# Altium schematic sheet CloudKon_WifiRelay.SchDoc
size A4
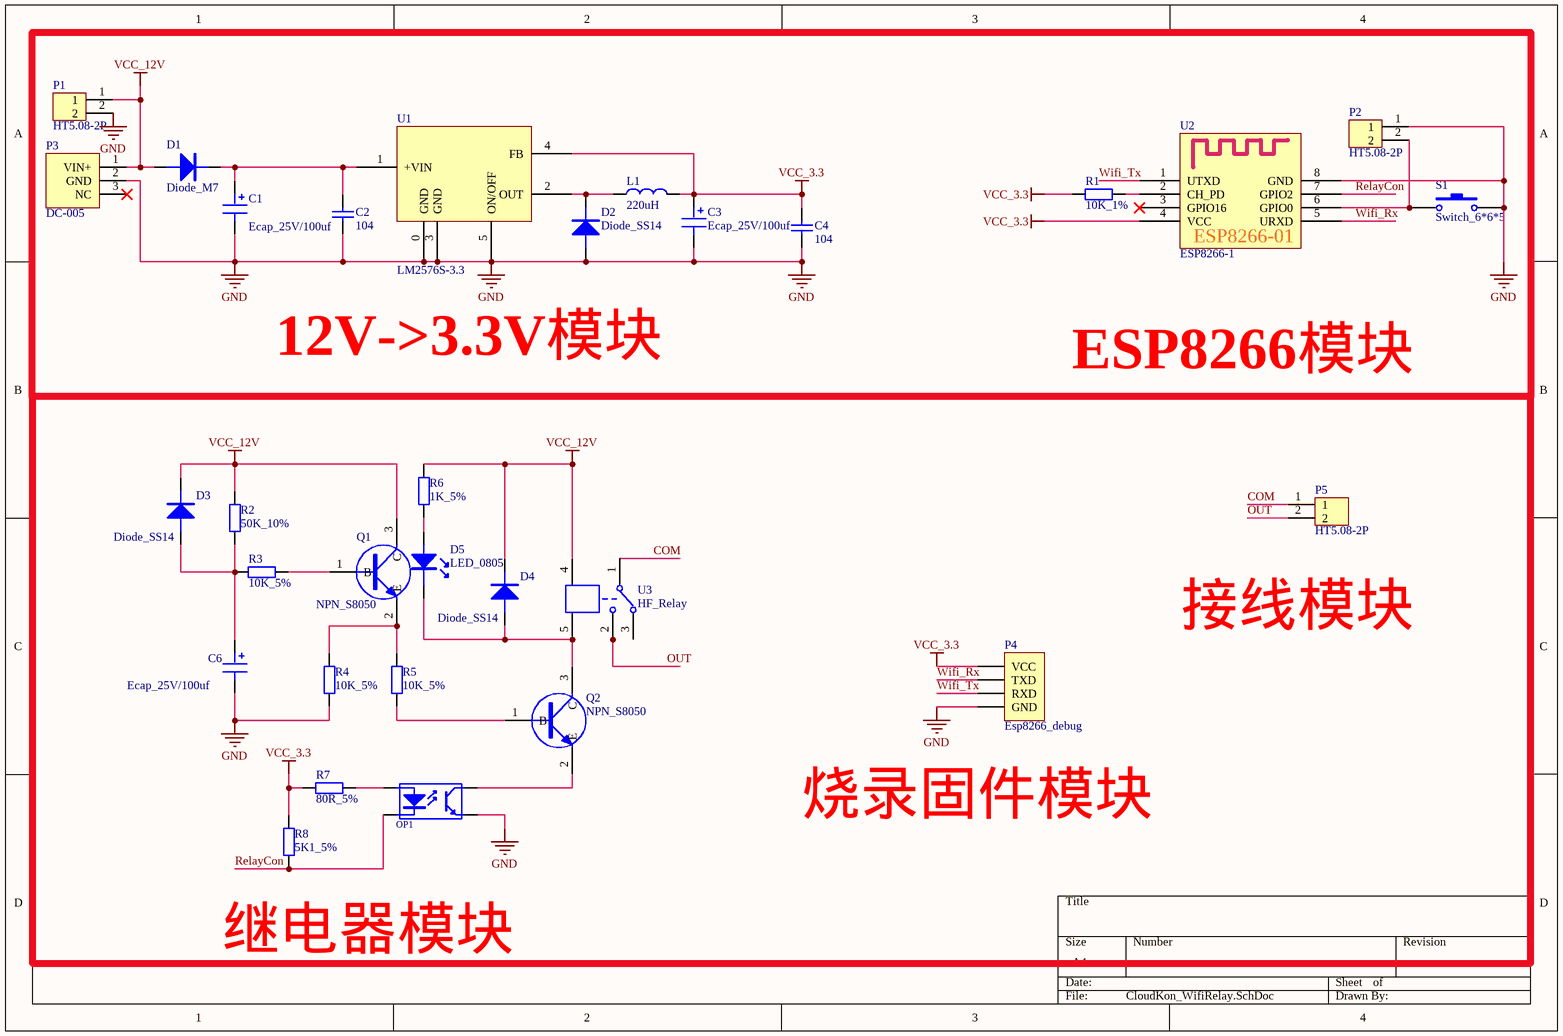
[diagram p0: CloudKon_WifiRelay.SchDoc]

## Parts
C1  Ecap_25V/100uf  [sip-cap-100uf-25v - duplicate]
C2  104  [0805_Cap]
C3  Ecap_25V/100uf  [sip-cap-100uf-25v - duplicate]
C4  104  [0805_Cap]
C6  Ecap_25V/100uf  [sip-cap-100uf-25v - duplicate]
D1  Diode_M7  [M7]
D2  Diode_SS14  [M7]
D3  Diode_SS14  [M7]
D4  Diode_SS14  [M7]
D5  LED_0805  [0805_LED]
L1  220uH  [LL_1A]
OP1  EL817  [E817-SMD]  (value not drawn)
P1  HT5.08-2P  [sip2]
P2  HT5.08-2P  [sip2]
P3  DC-005  [DC-5.5-2.1mm]
P4  Esp8266_debug  [sip4]
P5  HT5.08-2P  [HP2PA-5.08]
Q1  NPN_S8050  [SOT-23]
Q2  NPN_S8050  [SOT-23]
R1  10K_1%  [0805_Res]
R2  50K_10%  [0805_Res]
R3  10K_5%  [0805_Res]
R4  10K_5%  [0805_Res]
R5  10K_5%  [0805_Res]
R6  1K_5%  [0805_Res]
R7  80R_5%  [0805_Res]
R8  5K1_5%  [0805_Res]
S1  Switch_6*6*5  [4.5*4.5MM_SW]
U1  LM2576S-3.3  [LM2575-1]
U2  ESP8266-1  [ESP8266-1]
U3  HF_Relay  [JZ-32F-A]

## Nets
GND: C1.2 C2.1 C3.2 C4.1 C6.2 D2.A OP1.3(E) P1.2 P2.1 P3.2(GND) P4.4(GND) R4.2 S1.2 U1.0(GND) U1.3(GND) U1.5(ON/OFF) U2.8(GND)
VCC_3.3: C3.1 C4.2 L1.2 P4.1(VCC) R1.2 R7.1 R8.2 U1.4(FB) U2.4(VCC)
VCC_12V: D1.A D3.K D4.K P1.1 P3.1(VIN+) Q1.3(C) R2.1 R6.2 U3.4
COM: P5.1 U3.1
OUT: P5.2 U3.2
RelayCon: OP1.2(K) R8.1 U2.7(GPIO2)
Wifi_Rx: P4.2(TXD) U2.5(URXD)
Wifi_Tx: P4.3(RXD) U2.1(UTXD)
NetC1_1: C1.1 C2.2 D1.K U1.1(+VIN)
NetC6_1: C6.1 D3.A R2.2 R3.1
NetD2_K: D2.K L1.1 U1.2(OUT)
NetD4_A: D4.A D5.2 Q2.3(C) U3.5
NetD5_1: D5.1 R6.1
NetOP1_1: OP1.1(A) R7.2
NetOP1_4: OP1.4(C) Q2.2(E)
NetP2_2: P2.2 S1.1 U2.6(GPIO0)
NetQ1_1: Q1.1(B) R3.2
NetQ1_2: Q1.2(E) R4.1 R5.2
NetQ2_1: Q2.1(B) R5.1
NetR1_1: R1.1 U2.2(CH_PD)

Not connected (* = marked no-connect by the designer): P3 3(NC)*; U2 3(GPIO16)*; U3 3

## Notes on the sheet
- 12V->3.3V模块
- ESP8266模块
- 接线模块
- 烧录固件模块
- (near R8) 继电器模块
- (in symbol ESP8266-1) ESP8266-01

## Library data of the parts
C1 C3 C6 = Ecap_25V/100uf: https://item.taobao.com/item.htm?spm=a1z10.5-c.w4002-11020631983.33.qoX6of&id=7423722992; Price(RMB): 0.04
C2 C4 = Cap_%10: https://item.taobao.com/item.htm?spm=a1z09.2.0.0.hNveX1&id=9716419590&_u=7ok62qs2673; Price(RMB): 0.03
D1 = Diode_M7: https://item.taobao.com/item.htm?spm=a1z10.3-c.w4002-11020657456.37.E0r8Bv&id=2891923922; Price(RMB): 0.03
D2-D4 = Diode_SS14: https://item.taobao.com/item.htm?spm=a1z10.3-c.w4002-11020657456.14.qD67rq&id=6126767310; Price(RMB): 0.04
D5 = LED_0805: https://item.taobao.com/item.htm?spm=a1z10.3-c.w4002-11020657456.51.Ytz1qg&id=5169670346; Price(RMB): 0.03
L1 = LL_220uH: https://item.taobao.com/item.htm?spm=a1z10.3-c.w4002-11020657456.14.KHn9vQ&id=8986036232; Price(RMB): 0.1
OP1 = EL817: https://item.taobao.com/item.htm?spm=a1z10.3-c.w4002-11020657456.9.xiQJya&id=9840822052; Price(RMB): 0.17
P1 P2 P5 = HT5.08-2P: https://item.taobao.com/item.htm?spm=a1z10.3-c.w4002-11020657456.22.46QWsT&id=19327735027; Price(RMB): 0.26
P3 = DC-005: https://item.taobao.com/item.htm?spm=a1z10.3-c.w4002-11020657456.12.3OzBHB&id=5709638982; Price(RMB): 0.07
P4 = Esp8266_debug: https://item.taobao.com/item.htm?spm=a1z10.3-c.w4002-11020657456.14.NtUqGh&id=6097555742; Price(RMB): 0.013
Q1 Q2 = NPN_S8050: https://item.taobao.com/item.htm?spm=a1z10.3-c.w4002-11020657456.15.ysrU5Y&id=5957247576; Price(RMB): 0.03
R1-R8 = Res_%5: https://item.taobao.com/item.htm?spm=a1z10.3-c.w4002-11020657456.13.233szV&id=14686636311; Price(RMB): 0.01
S1 = Switch_6*6*5: https://item.taobao.com/item.htm?spm=a1z10.3-c.w4002-11020657456.46.btOzYB&id=6756135544; Price(RMB): 0.02
U1 = LM2576S-3.3: https://item.taobao.com/item.htm?spm=a1z10.3-c.w4002-11020657456.21.xl3HJG&id=6674225198; Price(RMB): 1.3
U2 = ESP8266-1: https://item.taobao.com/item.htm?spm=a1z10.3-c.w4002-5350375195.29.OjbIzM&id=40328222213; Price(RMB): 13.5
U3 = HF_Relay: https://item.taobao.com/item.htm?spm=a1z10.1-c.w9983160-11020631947.1.6Rxoz9&id=10387236348; Price(RMB): 1